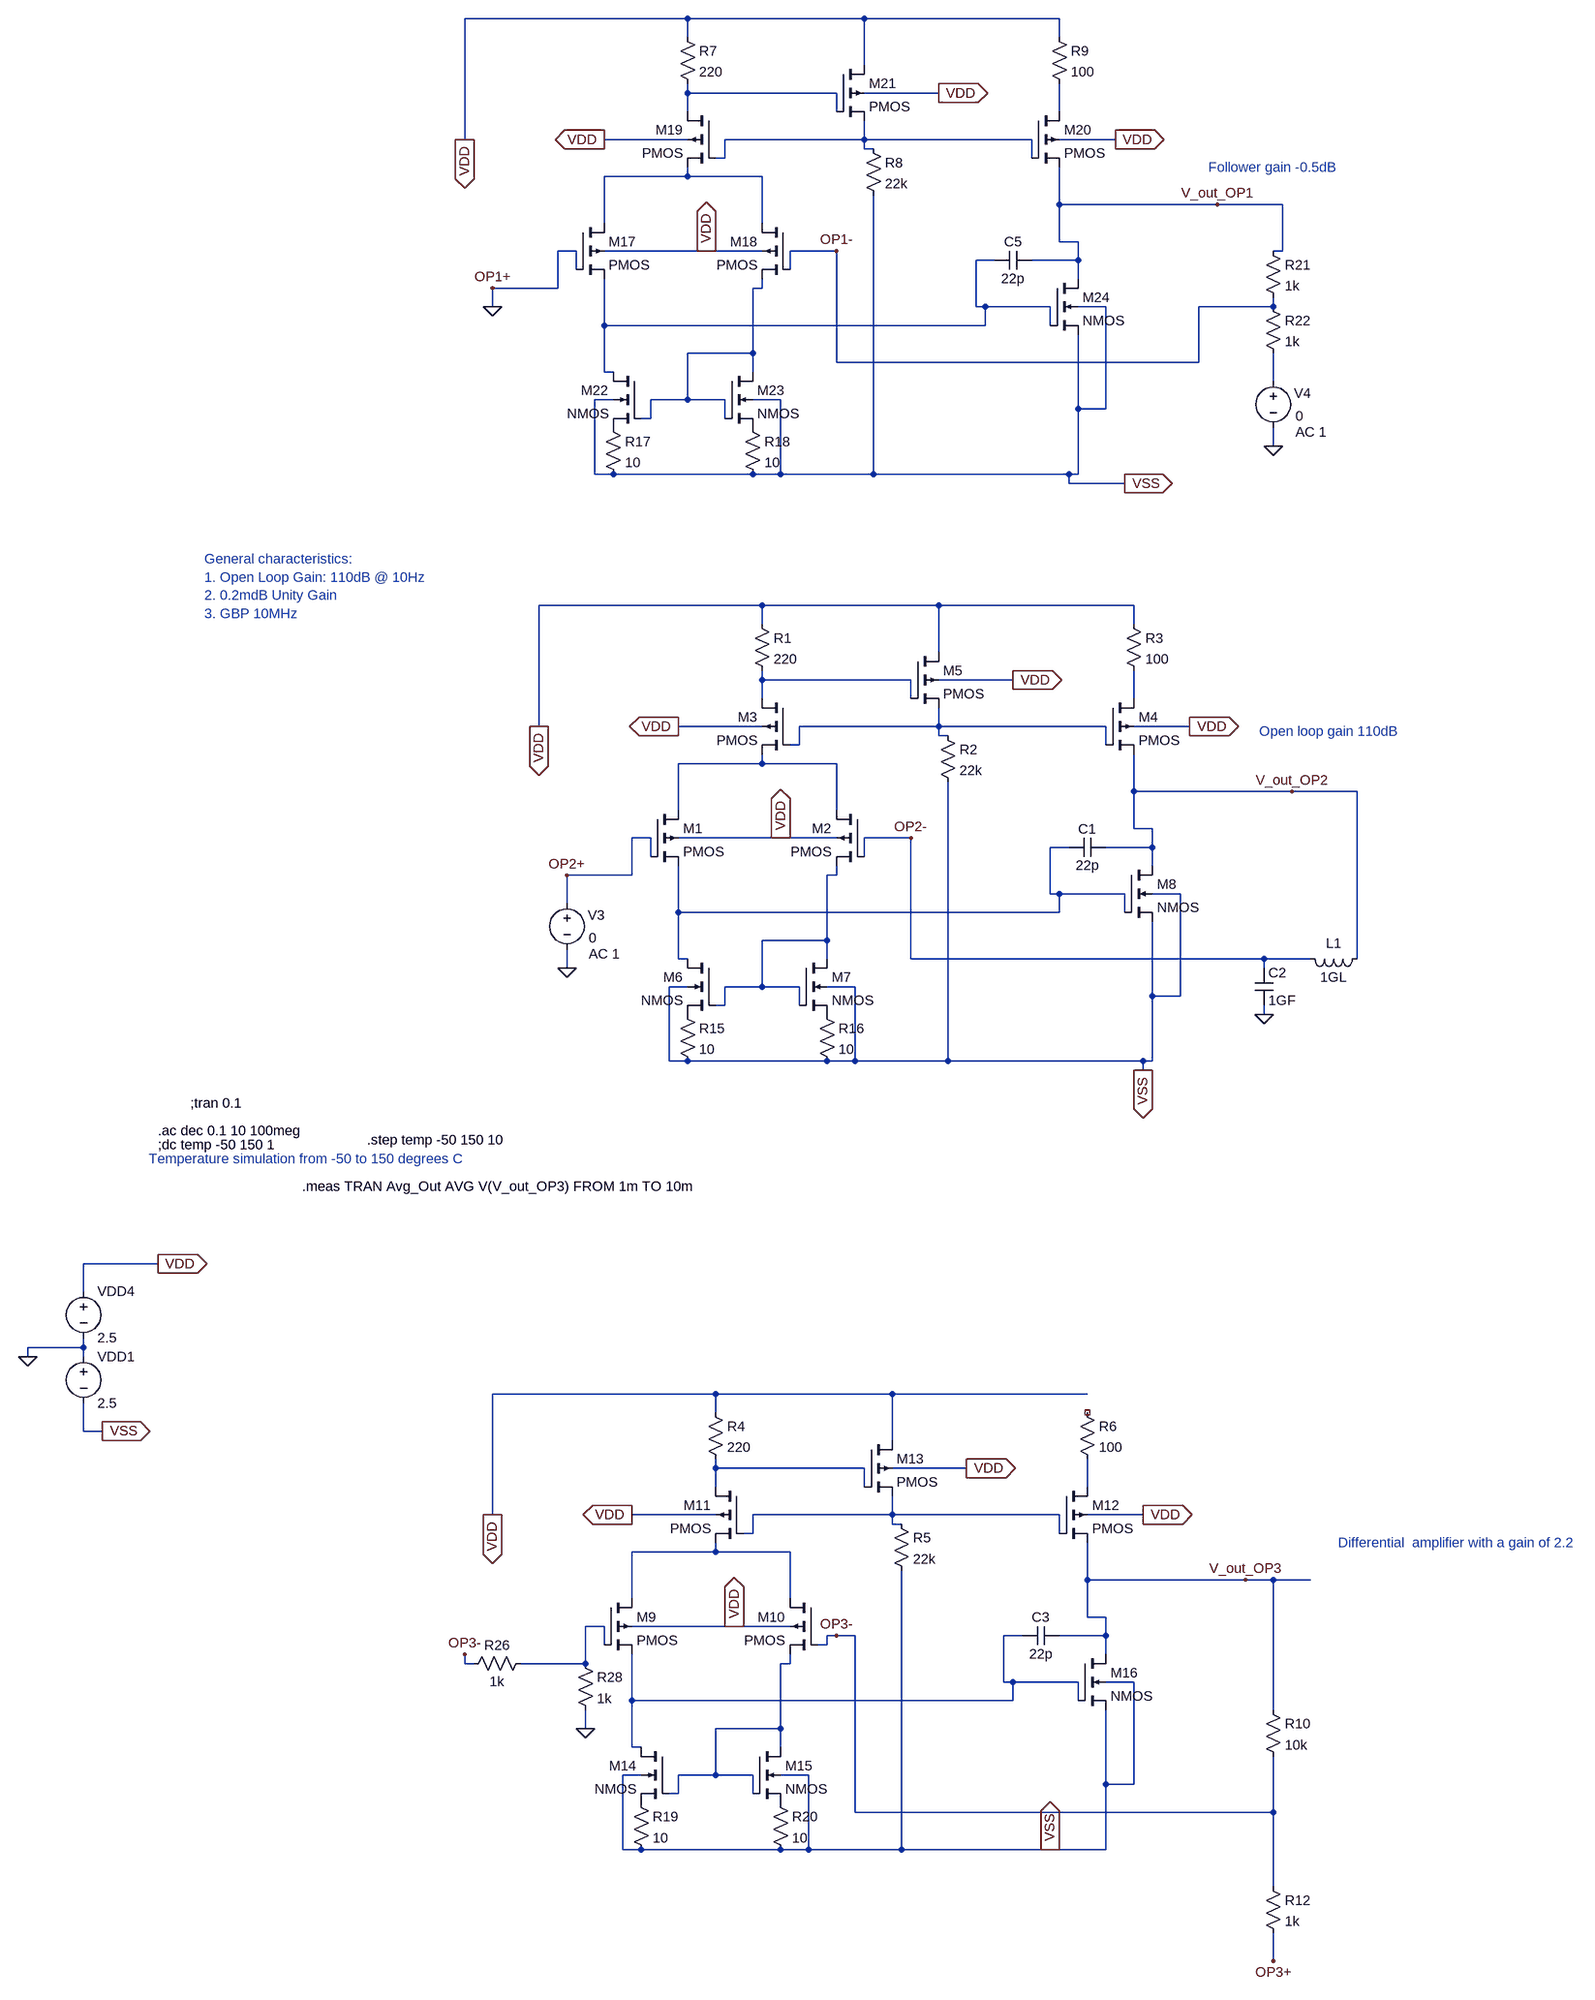
[diagram p0: schematic OP_amp_design.asc]
OP_amp_design.asc, the LTspice schematic file:
Version 4
SHEET 1 3816 3120
WIRE 272 -1232 -112 -1232
WIRE 576 -1232 272 -1232
WIRE 912 -1232 576 -1232
WIRE 272 -1200 272 -1232
WIRE 912 -1200 912 -1232
WIRE 576 -1152 576 -1232
WIRE 272 -1104 272 -1120
WIRE 528 -1104 272 -1104
WIRE 704 -1104 576 -1104
WIRE 272 -1072 272 -1104
WIRE 528 -1072 528 -1104
WIRE 912 -1072 912 -1120
WIRE -112 -1024 -112 -1232
WIRE 272 -1024 128 -1024
WIRE 576 -1024 576 -1056
WIRE 576 -1024 336 -1024
WIRE 864 -1024 576 -1024
WIRE 1008 -1024 912 -1024
WIRE 576 -1008 576 -1024
WIRE 592 -1008 576 -1008
WIRE 336 -992 336 -1024
WIRE 336 -992 320 -992
WIRE 864 -992 864 -1024
WIRE 272 -960 272 -976
WIRE 272 -960 128 -960
WIRE 400 -960 272 -960
WIRE 912 -912 912 -976
WIRE 1184 -912 912 -912
WIRE 1296 -912 1184 -912
WIRE 128 -880 128 -960
WIRE 400 -880 400 -960
WIRE 912 -848 912 -912
WIRE 944 -848 912 -848
WIRE 80 -832 48 -832
WIRE 304 -832 128 -832
WIRE 400 -832 304 -832
WIRE 528 -832 448 -832
WIRE 1296 -832 1296 -912
WIRE 1296 -832 1280 -832
WIRE 800 -816 768 -816
WIRE 944 -816 944 -848
WIRE 944 -816 864 -816
WIRE 80 -800 80 -832
WIRE 448 -800 448 -832
WIRE 944 -784 944 -816
WIRE 48 -768 48 -832
WIRE 48 -768 -64 -768
WIRE 400 -768 400 -784
WIRE 400 -768 384 -768
WIRE -64 -736 -64 -768
WIRE 768 -736 768 -816
WIRE 784 -736 768 -736
WIRE 896 -736 784 -736
WIRE 992 -736 944 -736
WIRE 1280 -736 1280 -752
WIRE 1280 -736 1152 -736
WIRE 128 -704 128 -784
WIRE 784 -704 784 -736
WIRE 784 -704 128 -704
WIRE 896 -704 896 -736
WIRE 384 -656 384 -768
WIRE 384 -656 272 -656
WIRE 528 -640 528 -832
WIRE 1152 -640 1152 -736
WIRE 1152 -640 528 -640
WIRE 128 -624 128 -704
WIRE 144 -624 128 -624
WIRE 384 -624 384 -656
WIRE 1280 -608 1280 -656
WIRE 144 -576 112 -576
WIRE 272 -576 272 -656
WIRE 272 -576 208 -576
WIRE 336 -576 272 -576
WIRE 432 -576 384 -576
WIRE 944 -560 944 -688
WIRE 992 -560 992 -736
WIRE 992 -560 944 -560
WIRE 208 -544 208 -576
WIRE 208 -544 192 -544
WIRE 336 -544 336 -576
WIRE 1280 -496 1280 -528
WIRE 112 -448 112 -576
WIRE 144 -448 112 -448
WIRE 384 -448 144 -448
WIRE 432 -448 432 -576
WIRE 432 -448 384 -448
WIRE 592 -448 592 -928
WIRE 592 -448 432 -448
WIRE 928 -448 592 -448
WIRE 944 -448 944 -560
WIRE 944 -448 928 -448
WIRE 928 -432 928 -448
WIRE 1024 -432 928 -432
WIRE 400 160 16 160
WIRE 704 160 400 160
WIRE 1040 160 704 160
WIRE 400 192 400 160
WIRE 1040 192 1040 160
WIRE 704 240 704 160
WIRE 400 288 400 272
WIRE 656 288 400 288
WIRE 832 288 704 288
WIRE 400 320 400 288
WIRE 656 320 656 288
WIRE 1040 320 1040 272
WIRE 16 368 16 160
WIRE 400 368 256 368
WIRE 704 368 704 336
WIRE 704 368 464 368
WIRE 992 368 704 368
WIRE 1136 368 1040 368
WIRE 704 384 704 368
WIRE 720 384 704 384
WIRE 464 400 464 368
WIRE 464 400 448 400
WIRE 992 400 992 368
WIRE 400 432 400 416
WIRE 400 432 256 432
WIRE 528 432 400 432
WIRE 1040 480 1040 416
WIRE 1312 480 1040 480
WIRE 1424 480 1312 480
WIRE 256 512 256 432
WIRE 528 512 528 432
WIRE 1040 544 1040 480
WIRE 1072 544 1040 544
WIRE 208 560 176 560
WIRE 432 560 256 560
WIRE 528 560 432 560
WIRE 656 560 576 560
WIRE 928 576 896 576
WIRE 1072 576 1072 544
WIRE 1072 576 992 576
WIRE 208 592 208 560
WIRE 576 592 576 560
WIRE 1072 608 1072 576
WIRE 176 624 176 560
WIRE 176 624 64 624
WIRE 528 624 528 608
WIRE 528 624 512 624
WIRE 896 656 896 576
WIRE 912 656 896 656
WIRE 1024 656 912 656
WIRE 1120 656 1072 656
WIRE 64 672 64 624
WIRE 256 688 256 608
WIRE 912 688 912 656
WIRE 912 688 256 688
WIRE 1024 688 1024 656
WIRE 512 736 512 624
WIRE 512 736 400 736
WIRE 256 768 256 688
WIRE 272 768 256 768
WIRE 512 768 512 736
WIRE 656 768 656 560
WIRE 1264 768 656 768
WIRE 1344 768 1264 768
WIRE 1424 768 1424 480
WIRE 64 784 64 752
WIRE 1264 784 1264 768
WIRE 272 816 240 816
WIRE 400 816 400 736
WIRE 400 816 336 816
WIRE 464 816 400 816
WIRE 560 816 512 816
WIRE 1072 832 1072 704
WIRE 1120 832 1120 656
WIRE 1120 832 1072 832
WIRE 336 848 336 816
WIRE 336 848 320 848
WIRE 464 848 464 816
WIRE 1264 864 1264 848
WIRE 240 944 240 816
WIRE 272 944 240 944
WIRE 512 944 272 944
WIRE 560 944 560 816
WIRE 560 944 512 944
WIRE 720 944 720 464
WIRE 720 944 560 944
WIRE 1056 944 720 944
WIRE 1072 944 1072 832
WIRE 1072 944 1056 944
WIRE 1056 960 1056 944
WIRE -640 1808 -768 1808
WIRE -768 1856 -768 1808
WIRE -768 1952 -768 1936
WIRE -768 1952 -864 1952
WIRE -864 1968 -864 1952
WIRE -768 1968 -768 1952
WIRE 320 2032 -64 2032
WIRE 624 2032 320 2032
WIRE 960 2032 624 2032
WIRE 320 2064 320 2032
WIRE -768 2096 -768 2048
WIRE -736 2096 -768 2096
WIRE 624 2112 624 2032
WIRE 320 2160 320 2144
WIRE 576 2160 320 2160
WIRE 752 2160 624 2160
WIRE 320 2192 320 2160
WIRE 576 2192 576 2160
WIRE 960 2192 960 2144
WIRE -64 2240 -64 2032
WIRE 320 2240 176 2240
WIRE 624 2240 624 2208
WIRE 624 2240 384 2240
WIRE 912 2240 624 2240
WIRE 1056 2240 960 2240
WIRE 624 2256 624 2240
WIRE 640 2256 624 2256
WIRE 384 2272 384 2240
WIRE 384 2272 368 2272
WIRE 912 2272 912 2240
WIRE 320 2304 320 2288
WIRE 320 2304 176 2304
WIRE 448 2304 320 2304
WIRE 960 2352 960 2288
WIRE 1232 2352 960 2352
WIRE 1280 2352 1232 2352
WIRE 1344 2352 1280 2352
WIRE 176 2384 176 2304
WIRE 448 2384 448 2304
WIRE 960 2416 960 2352
WIRE 992 2416 960 2416
WIRE 128 2432 96 2432
WIRE 352 2432 176 2432
WIRE 448 2432 352 2432
WIRE 528 2448 512 2448
WIRE 560 2448 528 2448
WIRE 848 2448 816 2448
WIRE 992 2448 992 2416
WIRE 992 2448 912 2448
WIRE 128 2464 128 2432
WIRE 512 2464 512 2448
WIRE 512 2464 496 2464
WIRE 992 2480 992 2448
WIRE -112 2496 -112 2480
WIRE -96 2496 -112 2496
WIRE 96 2496 96 2432
WIRE 96 2496 -16 2496
WIRE 448 2496 448 2480
WIRE 448 2496 432 2496
WIRE 816 2528 816 2448
WIRE 832 2528 816 2528
WIRE 944 2528 832 2528
WIRE 1040 2528 992 2528
WIRE 176 2560 176 2480
WIRE 832 2560 832 2528
WIRE 832 2560 176 2560
WIRE 944 2560 944 2528
WIRE 1280 2576 1280 2352
WIRE 96 2608 96 2576
WIRE 432 2608 432 2496
WIRE 432 2608 320 2608
WIRE 176 2640 176 2560
WIRE 192 2640 176 2640
WIRE 432 2640 432 2608
WIRE 192 2688 160 2688
WIRE 320 2688 320 2608
WIRE 320 2688 256 2688
WIRE 384 2688 320 2688
WIRE 480 2688 432 2688
WIRE 992 2704 992 2576
WIRE 1040 2704 1040 2528
WIRE 1040 2704 992 2704
WIRE 256 2720 256 2688
WIRE 256 2720 240 2720
WIRE 384 2720 384 2688
WIRE 560 2752 560 2448
WIRE 1280 2752 1280 2656
WIRE 1280 2752 560 2752
WIRE 160 2816 160 2688
WIRE 192 2816 160 2816
WIRE 432 2816 192 2816
WIRE 480 2816 480 2688
WIRE 480 2816 432 2816
WIRE 640 2816 640 2336
WIRE 640 2816 480 2816
WIRE 896 2816 640 2816
WIRE 992 2816 992 2704
WIRE 992 2816 896 2816
WIRE 1280 2880 1280 2752
WIRE 1280 3008 1280 2960
FLAG 1312 480 V_out_OP2
FLAG 256 368 VDD
IOPIN 256 368 Out
FLAG 832 288 VDD
IOPIN 832 288 Out
FLAG 1136 368 VDD
IOPIN 1136 368 Out
FLAG 432 560 VDD
IOPIN 432 560 Out
FLAG 1232 2352 V_out_OP3
FLAG 176 2240 VDD
IOPIN 176 2240 Out
FLAG 752 2160 VDD
IOPIN 752 2160 Out
FLAG 1056 2240 VDD
IOPIN 1056 2240 Out
FLAG 352 2432 VDD
IOPIN 352 2432 Out
FLAG 1184 -912 V_out_OP1
FLAG 128 -1024 VDD
IOPIN 128 -1024 Out
FLAG 704 -1104 VDD
IOPIN 704 -1104 Out
FLAG 1008 -1024 VDD
IOPIN 1008 -1024 Out
FLAG 304 -832 VDD
IOPIN 304 -832 Out
FLAG -864 1968 0
FLAG -640 1808 VDD
IOPIN -640 1808 Out
FLAG -736 2096 VSS
IOPIN -736 2096 Out
FLAG 896 2816 VSS
IOPIN 896 2816 Out
FLAG -64 2240 VDD
IOPIN -64 2240 Out
FLAG 1056 960 VSS
IOPIN 1056 960 Out
FLAG 16 368 VDD
IOPIN 16 368 Out
FLAG 1024 -432 VSS
IOPIN 1024 -432 Out
FLAG -112 -1024 VDD
IOPIN -112 -1024 Out
FLAG 64 624 OP2+
FLAG 656 560 OP2-
FLAG -64 -768 OP1+
FLAG 528 -832 OP1-
FLAG 64 784 0
FLAG 1264 864 0
FLAG 1280 -496 0
FLAG -64 -736 0
FLAG 96 2608 0
FLAG 1280 3008 OP3+
FLAG -112 2480 OP3-
FLAG 528 2448 OP3-
SYMBOL res 384 176 R0
SYMATTR InstName R1
SYMATTR Value 220
SYMBOL res 704 368 R0
SYMATTR InstName R2
SYMATTR Value 22k
SYMBOL res 1024 176 R0
SYMATTR InstName R3
SYMATTR Value 100
SYMBOL cap 992 560 R90
WINDOW 0 0 32 VBottom 2
WINDOW 3 32 32 VTop 2
SYMATTR InstName C1
SYMATTR Value 22p
SYMBOL pmos4 208 512 R0
SYMATTR InstName M1
SYMATTR Value2 l=7.8e-6 w=1.106e-3 as=4.825e-8 ps=3.82e-3 ad=1.286e-8
SYMBOL pmos4 576 512 M0
SYMATTR InstName M2
SYMATTR Value2 l=7.8e-6 w=1.106e-3 as=4.825e-8 ps=3.82e-3 ad=1.286e-8
SYMBOL pmos4 448 320 M0
SYMATTR InstName M3
SYMATTR Value2 l=7.8e-6 w=1.106e-3 as=4.825e-8 ps=3.82e-3 ad=1.286e-8
SYMBOL pmos4 992 320 R0
SYMATTR InstName M4
SYMATTR Value2 l=7.8e-6 w=1.106e-3 as=4.825e-8 ps=3.82e-3 ad=1.286e-8
SYMBOL pmos4 656 240 R0
SYMATTR InstName M5
SYMATTR Value2 l=7.8e-6 w=1.106e-3 as=4.825e-8 ps=3.82e-3 ad=1.286e-8
SYMBOL nmos4 320 768 M0
SYMATTR InstName M6
SYMATTR Value2 l=7.8e-6 w=1.106e-3 as=4.825e-8 ps=3.82e-3 ad=1.286e-8
SYMBOL nmos4 464 768 R0
SYMATTR InstName M7
SYMATTR Value2 l=7.8e-6 w=1.106e-3 as=4.825e-8 ps=3.82e-3 ad=1.286e-8
SYMBOL nmos4 1024 608 R0
SYMATTR InstName M8
SYMATTR Value2 l=7.8e-6 w=1.106e-3 as=4.825e-8 ps=3.82e-3 ad=1.286e-8
SYMBOL voltage -768 1952 R0
WINDOW 123 0 0 Left 0
WINDOW 39 0 0 Left 0
SYMATTR InstName VDD1
SYMATTR Value 2.5
SYMBOL res 304 2048 R0
SYMATTR InstName R4
SYMATTR Value 220
SYMBOL res 624 2240 R0
SYMATTR InstName R5
SYMATTR Value 22k
SYMBOL res 944 2048 R0
SYMATTR InstName R6
SYMATTR Value 100
SYMBOL cap 912 2432 R90
WINDOW 0 0 32 VBottom 2
WINDOW 3 32 32 VTop 2
SYMATTR InstName C3
SYMATTR Value 22p
SYMBOL pmos4 128 2384 R0
SYMATTR InstName M9
SYMATTR Value2 l=7.8e-6 w=1.106e-3 as=4.825e-8 ps=3.82e-3 ad=1.286e-8
SYMBOL pmos4 496 2384 M0
SYMATTR InstName M10
SYMATTR Value2 l=7.8e-6 w=1.106e-3 as=4.825e-8 ps=3.82e-3 ad=1.286e-8
SYMBOL pmos4 368 2192 M0
SYMATTR InstName M11
SYMATTR Value2 l=7.8e-6 w=1.106e-3 as=4.825e-8 ps=3.82e-3 ad=1.286e-8
SYMBOL pmos4 912 2192 R0
SYMATTR InstName M12
SYMATTR Value2 l=7.8e-6 w=1.106e-3 as=4.825e-8 ps=3.82e-3 ad=1.286e-8
SYMBOL pmos4 576 2112 R0
SYMATTR InstName M13
SYMATTR Value2 l=7.8e-6 w=1.106e-3 as=4.825e-8 ps=3.82e-3 ad=1.286e-8
SYMBOL nmos4 240 2640 M0
SYMATTR InstName M14
SYMATTR Value2 l=7.8e-6 w=1.106e-3 as=4.825e-8 ps=3.82e-3 ad=1.286e-8
SYMBOL nmos4 384 2640 R0
SYMATTR InstName M15
SYMATTR Value2 l=7.8e-6 w=1.106e-3 as=4.825e-8 ps=3.82e-3 ad=1.286e-8
SYMBOL nmos4 944 2480 R0
SYMATTR InstName M16
SYMATTR Value2 l=7.8e-6 w=1.106e-3 as=4.825e-8 ps=3.82e-3 ad=1.286e-8
SYMBOL res 256 -1216 R0
SYMATTR InstName R7
SYMATTR Value 220
SYMBOL res 576 -1024 R0
SYMATTR InstName R8
SYMATTR Value 22k
SYMBOL res 896 -1216 R0
SYMATTR InstName R9
SYMATTR Value 100
SYMBOL cap 864 -832 R90
WINDOW 0 0 32 VBottom 2
WINDOW 3 32 32 VTop 2
SYMATTR InstName C5
SYMATTR Value 22p
SYMBOL pmos4 80 -880 R0
SYMATTR InstName M17
SYMATTR Value2 l=7.8e-6 w=1.106e-3 as=4.825e-8 ps=3.82e-3 ad=1.286e-8
SYMBOL pmos4 448 -880 M0
SYMATTR InstName M18
SYMATTR Value2 l=7.8e-6 w=1.106e-3 as=4.825e-8 ps=3.82e-3 ad=1.286e-8
SYMBOL pmos4 320 -1072 M0
SYMATTR InstName M19
SYMATTR Value2 l=7.8e-6 w=1.106e-3 as=4.825e-8 ps=3.82e-3 ad=1.286e-8
SYMBOL pmos4 864 -1072 R0
SYMATTR InstName M20
SYMATTR Value2 l=7.8e-6 w=1.106e-3 as=4.825e-8 ps=3.82e-3 ad=1.286e-8
SYMBOL pmos4 528 -1152 R0
SYMATTR InstName M21
SYMATTR Value2 l=7.8e-6 w=1.106e-3 as=4.825e-8 ps=3.82e-3 ad=1.286e-8
SYMBOL nmos4 192 -624 M0
SYMATTR InstName M22
SYMATTR Value2 l=7.8e-6 w=1.106e-3 as=4.825e-8 ps=3.82e-3 ad=1.286e-8
SYMBOL nmos4 336 -624 R0
SYMATTR InstName M23
SYMATTR Value2 l=7.8e-6 w=1.106e-3 as=4.825e-8 ps=3.82e-3 ad=1.286e-8
SYMBOL nmos4 896 -784 R0
SYMATTR InstName M24
SYMATTR Value2 l=7.8e-6 w=1.106e-3 as=4.825e-8 ps=3.82e-3 ad=1.286e-8
SYMBOL voltage -768 1840 R0
WINDOW 123 0 0 Left 0
WINDOW 39 0 0 Left 0
SYMATTR InstName VDD4
SYMATTR Value 2.5
SYMBOL res 256 848 R0
SYMATTR InstName R15
SYMATTR Value 10
SYMBOL res 496 848 R0
SYMATTR InstName R16
SYMATTR Value 10
SYMBOL res 128 -544 R0
SYMATTR InstName R17
SYMATTR Value 10
SYMBOL res 368 -544 R0
SYMATTR InstName R18
SYMATTR Value 10
SYMBOL res 176 2720 R0
SYMATTR InstName R19
SYMATTR Value 10
SYMBOL res 416 2720 R0
SYMATTR InstName R20
SYMATTR Value 10
SYMBOL res 1264 2560 R0
SYMATTR InstName R10
SYMATTR Value 10k
SYMBOL voltage 64 656 R0
WINDOW 0 36 37 Left 2
WINDOW 3 38 76 Left 2
WINDOW 123 38 104 Left 2
WINDOW 39 0 0 Left 0
SYMATTR InstName V3
SYMATTR Value 0
SYMATTR Value2 AC 1
SYMBOL cap 1248 784 R0
SYMATTR InstName C2
SYMATTR Value 1GF
SYMBOL ind 1440 752 R90
WINDOW 0 5 56 VBottom 2
WINDOW 3 32 56 VTop 2
SYMATTR InstName L1
SYMATTR Value 1GL
SYMBOL voltage 1280 -624 R0
WINDOW 0 36 37 Left 2
WINDOW 3 38 76 Left 2
WINDOW 123 38 104 Left 2
WINDOW 39 0 0 Left 0
SYMATTR InstName V4
SYMATTR Value 0
SYMATTR Value2 AC 1
SYMBOL res 1264 -848 R0
SYMATTR InstName R21
SYMATTR Value 1k
SYMBOL res 1264 -752 R0
SYMATTR InstName R22
SYMATTR Value 1k
SYMBOL res 0 2480 R90
WINDOW 0 0 56 VBottom 2
WINDOW 3 32 56 VTop 2
SYMATTR InstName R26
SYMATTR Value 1k
SYMBOL res 80 2480 R0
SYMATTR InstName R28
SYMATTR Value 1k
SYMBOL res 1264 2864 R0
SYMATTR InstName R12
SYMATTR Value 1k
TEXT -640 1064 Left 2 !.ac dec 0.1 10 100meg
TEXT -584 1016 Left 2 !;tran 0.1
TEXT -560 80 Left 2 ;General characteristics:\n1. Open Loop Gain: 110dB @ 10Hz\n2. 0.2mdB Unity Gain\n3. GBP 10MHz
TEXT 1168 -976 Left 2 ;Follower gain -0.5dB
TEXT 1256 376 Left 2 ;Open loop gain 110dB
TEXT -640 1088 Left 2 !;dc temp -50 150 1
TEXT 1392 2288 Left 2 ;Differential  amplifier with a gain of 2.2
TEXT -656 1112 Left 2 ;Temperature simulation from -50 to 150 degrees C
TEXT -280 1080 Left 2 !.step temp -50 150 10
TEXT -392 1160 Left 2 !.meas TRAN Avg_Out AVG V(V_out_OP3) FROM 1m TO 10m

The netlist it stands for:
* OP_amp_design.asc
R1 VDD N008 220
R2 N010 VSS 22k
R3 VDD N009 100
C1 V_out_OP2 N012 22p
M1 N011 OP2+ N012 VDD PMOS l=7.8e-6 w=1.106e-3 as=4.825e-8 ps=3.82e-3 ad=1.286e-8
M2 N011 OP2- N013 VDD PMOS l=7.8e-6 w=1.106e-3 as=4.825e-8 ps=3.82e-3 ad=1.286e-8
M3 N008 N010 N011 VDD PMOS l=7.8e-6 w=1.106e-3 as=4.825e-8 ps=3.82e-3 ad=1.286e-8
M4 N009 N010 V_out_OP2 VDD PMOS l=7.8e-6 w=1.106e-3 as=4.825e-8 ps=3.82e-3 ad=1.286e-8
M5 VDD N008 N010 VDD PMOS l=7.8e-6 w=1.106e-3 as=4.825e-8 ps=3.82e-3 ad=1.286e-8
M6 N012 N013 P001 VSS NMOS l=7.8e-6 w=1.106e-3 as=4.825e-8 ps=3.82e-3 ad=1.286e-8
M7 N013 N013 P002 VSS NMOS l=7.8e-6 w=1.106e-3 as=4.825e-8 ps=3.82e-3 ad=1.286e-8
M8 V_out_OP2 N012 VSS VSS NMOS l=7.8e-6 w=1.106e-3 as=4.825e-8 ps=3.82e-3 ad=1.286e-8
VDD1 0 VSS 2.5
R4 VDD N014 220
R5 N016 VSS 22k
R6 NC_01 N015 100
C3 V_out_OP3 N019 22p
M9 N017 N018 N019 VDD PMOS l=7.8e-6 w=1.106e-3 as=4.825e-8 ps=3.82e-3 ad=1.286e-8
M10 N017 OP3- N020 VDD PMOS l=7.8e-6 w=1.106e-3 as=4.825e-8 ps=3.82e-3 ad=1.286e-8
M11 N014 N016 N017 VDD PMOS l=7.8e-6 w=1.106e-3 as=4.825e-8 ps=3.82e-3 ad=1.286e-8
M12 N015 N016 V_out_OP3 VDD PMOS l=7.8e-6 w=1.106e-3 as=4.825e-8 ps=3.82e-3 ad=1.286e-8
M13 VDD N014 N016 VDD PMOS l=7.8e-6 w=1.106e-3 as=4.825e-8 ps=3.82e-3 ad=1.286e-8
M14 N019 N020 P003 VSS NMOS l=7.8e-6 w=1.106e-3 as=4.825e-8 ps=3.82e-3 ad=1.286e-8
M15 N020 N020 P004 VSS NMOS l=7.8e-6 w=1.106e-3 as=4.825e-8 ps=3.82e-3 ad=1.286e-8
M16 V_out_OP3 N019 VSS VSS NMOS l=7.8e-6 w=1.106e-3 as=4.825e-8 ps=3.82e-3 ad=1.286e-8
R7 VDD N001 220
R8 N003 VSS 22k
R9 VDD N002 100
C5 V_out_OP1 N005 22p
M17 N004 0 N005 VDD PMOS l=7.8e-6 w=1.106e-3 as=4.825e-8 ps=3.82e-3 ad=1.286e-8
M18 N004 OP1- N006 VDD PMOS l=7.8e-6 w=1.106e-3 as=4.825e-8 ps=3.82e-3 ad=1.286e-8
M19 N001 N003 N004 VDD PMOS l=7.8e-6 w=1.106e-3 as=4.825e-8 ps=3.82e-3 ad=1.286e-8
M20 N002 N003 V_out_OP1 VDD PMOS l=7.8e-6 w=1.106e-3 as=4.825e-8 ps=3.82e-3 ad=1.286e-8
M21 VDD N001 N003 VDD PMOS l=7.8e-6 w=1.106e-3 as=4.825e-8 ps=3.82e-3 ad=1.286e-8
M22 N005 N006 P005 VSS NMOS l=7.8e-6 w=1.106e-3 as=4.825e-8 ps=3.82e-3 ad=1.286e-8
M23 N006 N006 P006 VSS NMOS l=7.8e-6 w=1.106e-3 as=4.825e-8 ps=3.82e-3 ad=1.286e-8
M24 V_out_OP1 N005 VSS VSS NMOS l=7.8e-6 w=1.106e-3 as=4.825e-8 ps=3.82e-3 ad=1.286e-8
VDD4 VDD 0 2.5
R15 P001 VSS 10
R16 P002 VSS 10
R17 P005 VSS 10
R18 P006 VSS 10
R19 P003 VSS 10
R20 P004 VSS 10
R10 V_out_OP3 OP3- 10k
V3 OP2+ 0 0 AC 1
C2 OP2- 0 1GF
L1 V_out_OP2 OP2- 1GL
V4 N007 0 0 AC 1
R21 V_out_OP1 OP1- 1k
R22 OP1- N007 1k
R26 N018 OP3- 1k
R28 N018 0 1k
R12 OP3- OP3+ 1k
.model NMOS NMOS
.model PMOS PMOS
.lib standard.mos
.ac dec 0.1 10 100meg
;tran 0.1
* General characteristics:
* 1. Open Loop Gain: 110dB @ 10Hz
* 2. 0.2mdB Unity Gain
* 3. GBP 10MHz
* Follower gain -0.5dB
* Open loop gain 110dB
;dc temp -50 150 1
* Differential  amplifier with a gain of 2.2
* Temperature simulation from -50 to 150 degrees C
.step temp -50 150 10
.meas TRAN Avg_Out AVG V(V_out_OP3) FROM 1m TO 10m
.backanno
.end